# EAGLE design horta (EAGLE 9.6.2)
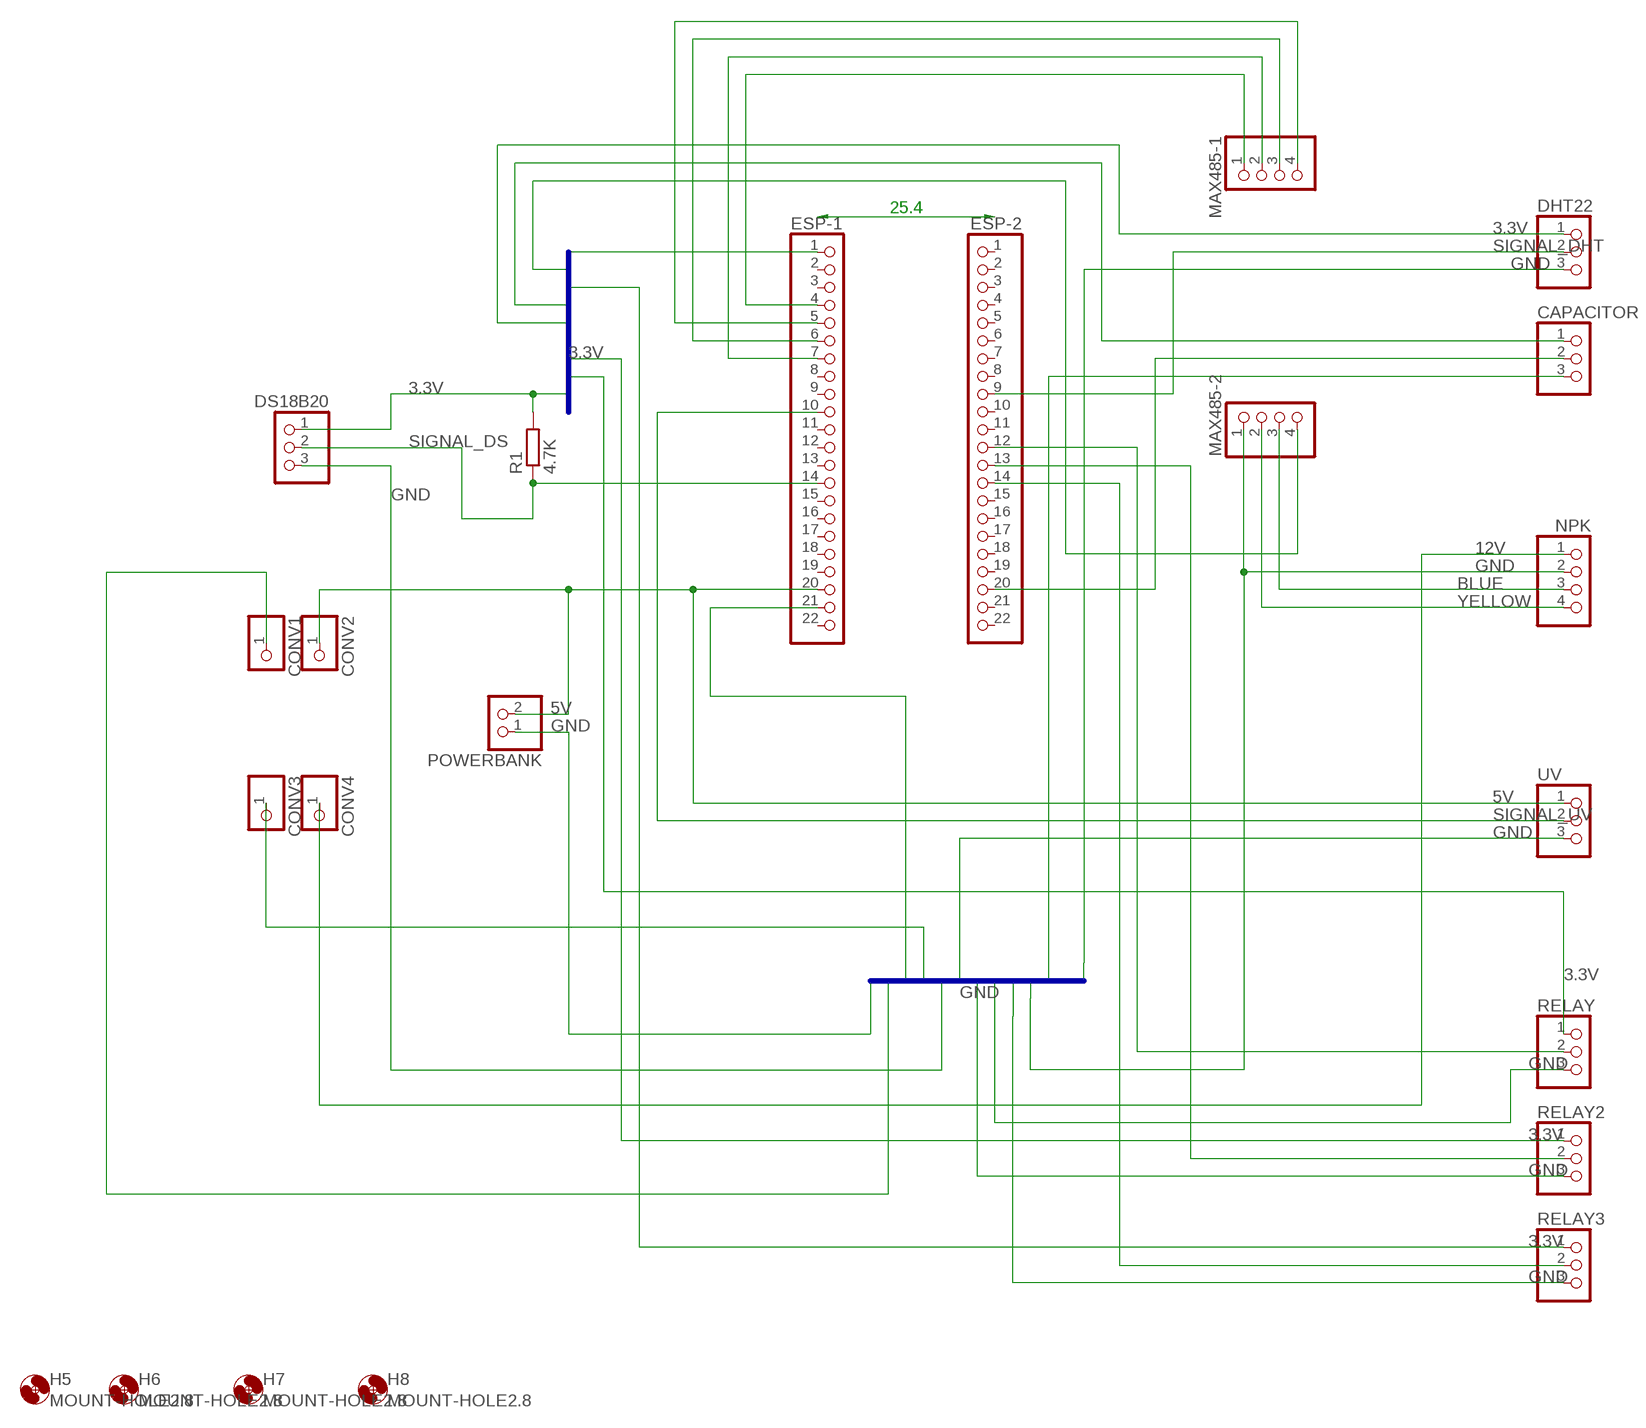
[diagram p0: schematic, sheet 1]

## Parts
CAPACITOR  PINHD-1X3  [1X03]
CONV1  PINHD-1X1  [1X01]
CONV2  PINHD-1X1  [1X01]
CONV3  PINHD-1X1  [1X01]
CONV4  PINHD-1X1  [1X01]
DHT22  PINHD-1X3  [1X03]
DS18B20  PINHD-1X3  [1X03]
ESP-1  PINHD-1X22  [1X22]
ESP-2  PINHD-1X22  [1X22]
H5  MOUNT-HOLE2.8  [2,8]
H6  MOUNT-HOLE2.8  [2,8]
H7  MOUNT-HOLE2.8  [2,8]
H8  MOUNT-HOLE2.8  [2,8]
MAX485-1  PINHD-1X4  [1X04]
MAX485-2  PINHD-1X4  [1X04]
NPK  PINHD-1X4  [1X04]
POWERBANK  PINHD-1X2  [1X02]
R1  4.7K  R-EU_0207/10  [0207/10]
RELAY  PINHD-1X3  [1X03]
RELAY2  PINHD-1X3  [1X03]
RELAY3  PINHD-1X3  [1X03]
UV  PINHD-1X3  [1X03]

## Nets
3.3V: CAPACITOR.1 DHT22.1 DS18B20.1 ESP-1.1 MAX485-2.4 R1.2 RELAY2.1 RELAY3.1 RELAY.1
5V: CONV2.1 ESP-1.20 POWERBANK.2 UV.1
12V: CONV4.1 NPK.1
BLUE: MAX485-2.3 NPK.3
GND: CAPACITOR.3 CONV1.1 CONV3.1 DHT22.3 DS18B20.3 ESP-1.21 MAX485-2.1 NPK.2 POWERBANK.1 RELAY2.3 RELAY3.3 RELAY.3 UV.3
N$1: ESP-1.4 MAX485-1.1
N$2: ESP-1.5 MAX485-1.4
N$3: ESP-1.6 MAX485-1.3
N$4: ESP-1.7 MAX485-1.2
N$5: ESP-2.12 RELAY.2
N$6: CAPACITOR.2 ESP-2.20
N$12: ESP-2.14 RELAY3.2
N$13: ESP-2.13 RELAY2.2
SIGNAL_DHT: DHT22.2 ESP-2.9
SIGNAL_DS: DS18B20.2 ESP-1.14 R1.1
SIGNAL_UV: ESP-1.10 UV.2
YELLOW: MAX485-2.2 NPK.4
Unconnected: ESP-1.2 ESP-1.3 ESP-1.8 ESP-1.9 ESP-1.11 ESP-1.12 ESP-1.13 ESP-1.15 ESP-1.16 ESP-1.17 ESP-1.18 ESP-1.19 ESP-1.22 ESP-2.1 ESP-2.2 ESP-2.3 ESP-2.4 ESP-2.5 ESP-2.6 ESP-2.7 ESP-2.8 ESP-2.10 ESP-2.11 ESP-2.15 ESP-2.16 ESP-2.17 ESP-2.18 ESP-2.19 ESP-2.21 ESP-2.22

## Buses
3.3V
GND

## Library data of the parts
CAPACITOR DHT22 DS18B20 RELAY RELAY2 RELAY3 UV = pinhead:PINHD-1X3: PIN HEADER
CONV1-CONV4 = pinhead:PINHD-1X1: PIN HEADER
ESP-1 ESP-2 = pinhead:PINHD-1X22: PIN HEADER
H5-H8 = holes:MOUNT-HOLE: MOUNTING HOLE with drill center marker
MAX485-1 MAX485-2 NPK = pinhead:PINHD-1X4: PIN HEADER
POWERBANK = pinhead:PINHD-1X2: PIN HEADER
R1 = ada4622:R-EU_: RESISTOR, European symbol

## Board
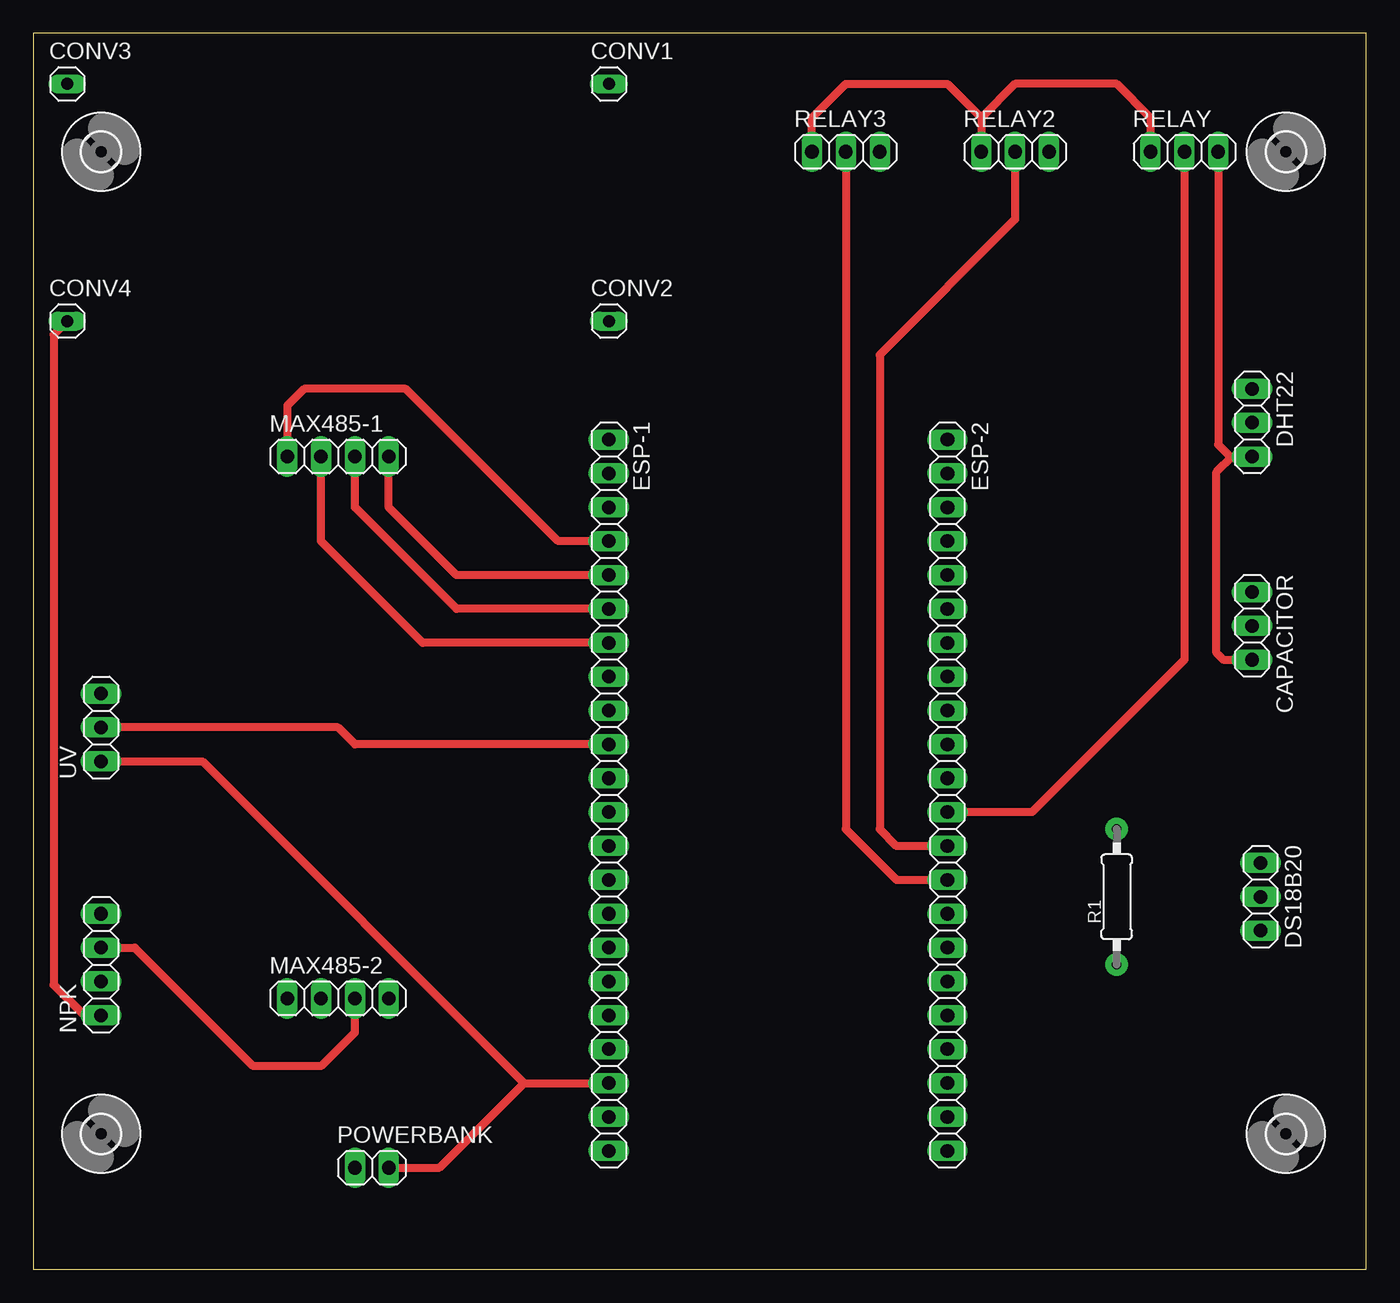
[diagram p1: board, top side]
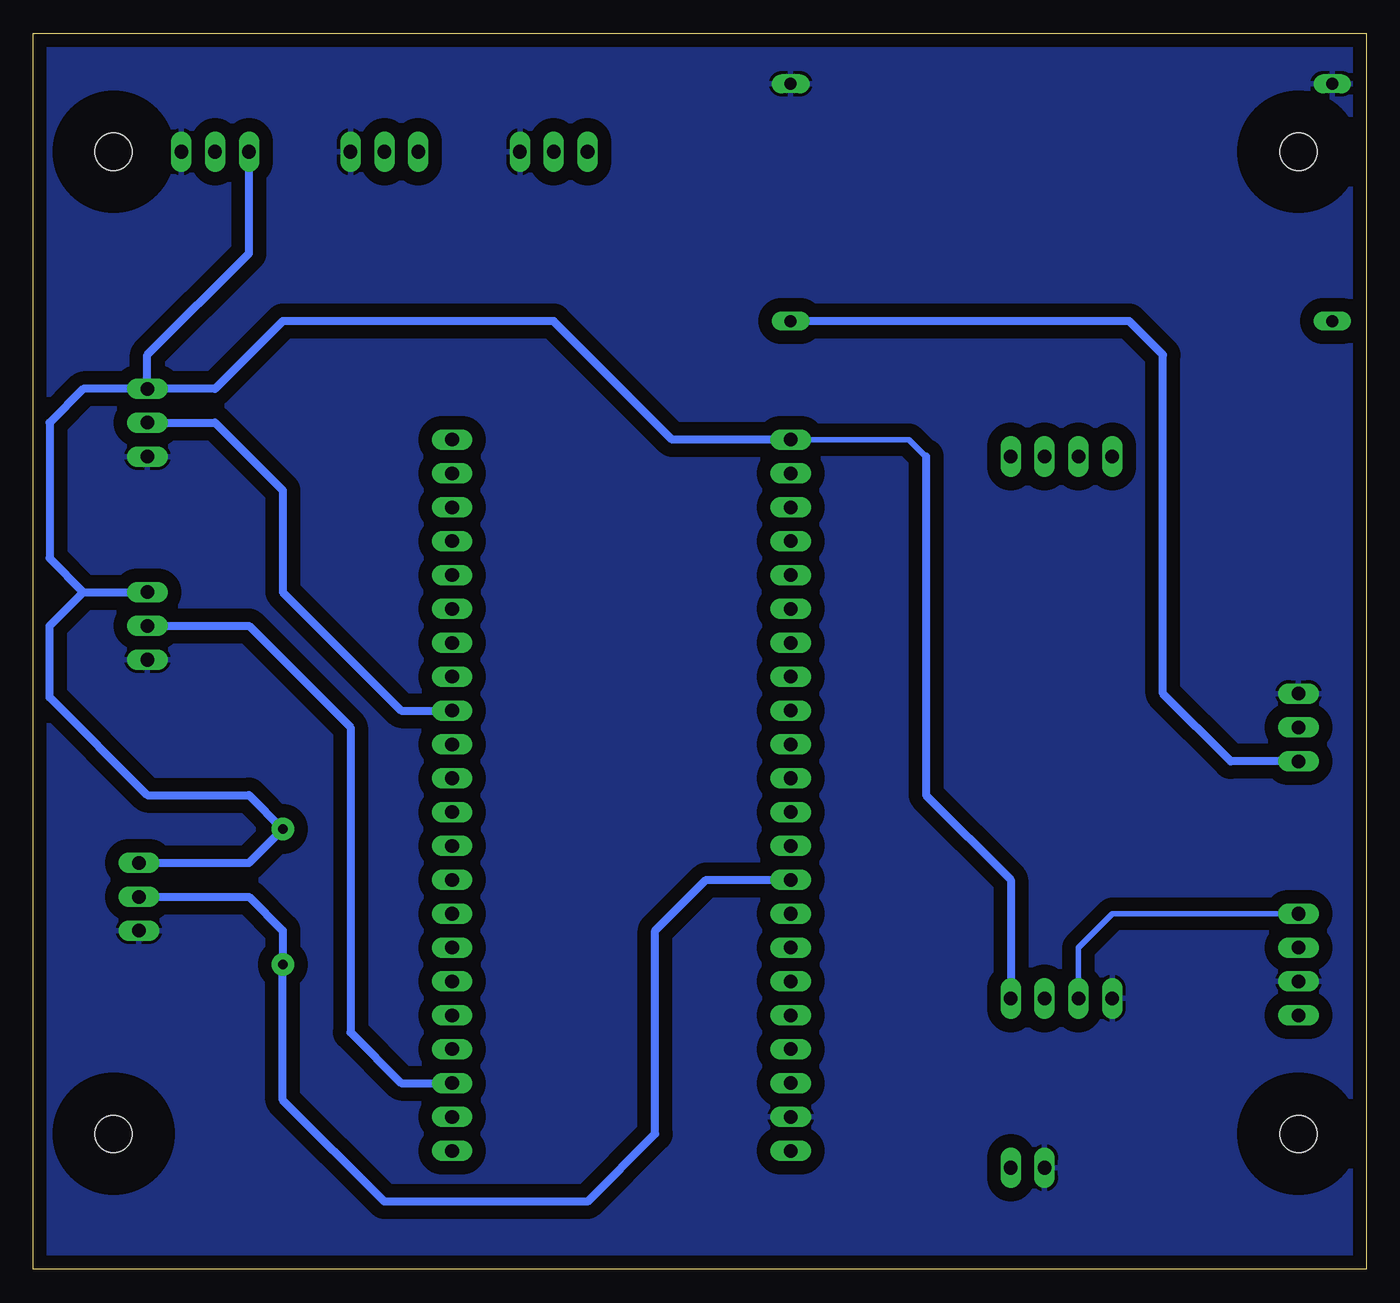
[diagram p2: board, bottom side, seen from below]

Size 100 x 92.7 mm. Coordinates in mm from the lower left corner, seen from the top.
Outline: 0,0 100,0 100,92.7 0,92.7 0,0
Copper layers (1*16): Top 0.035mm / dielectric 1.5mm / Bottom 0.035mm
Design rules "default": minimum track width 6mil, minimum drill 0.35mm, track to track 6mil, track to pad 6mil, pad to pad 6mil, via to via 6mil, smd to smd 6mil, copper to edge 40mil, drill to drill 6mil, minimum pad ring 10mil, minimum via ring 8mil, stop-mask expansion 4mil, vias tented up to drill 0mil, thermal gap 10mil

### Footprints (pad centres in the part's own frame; a part is rotated, then mirrored left to right if it is on the bottom)
1X03 = drill 1.016 long: 1 -2.54,0; 2 0,0; 3 2.54,0
1X01 = drill 0.9 pad 1.3 long: 1 0,0
1X22 = drill 1.016 long: 1 -26.67,0; 2 -24.13,0; 3 -21.59,0; 4 -19.05,0; 5 -16.51,0; 6 -13.97,0; 7 -11.43,0; 8 -8.89,0; 9 -6.35,0; 10 -3.81,0; 11 -1.27,0; 12 1.27,0; 13 3.81,0; 14 6.35,0; 15 8.89,0; 16 11.43,0; 17 13.97,0; 18 16.51,0; 19 19.05,0; 20 21.59,0; 21 24.13,0; 22 26.67,0
2,8 = hole 2.8: 0,0
1X04 = drill 1.016 long: 1 -3.81,0; 2 -1.27,0; 3 1.27,0; 4 3.81,0
1X02 = drill 1.016 long: 1 -1.27,0; 2 1.27,0
0207/10 = drill 0.7 pad 1.676: 1 -5.08,0; 2 5.08,0

### Placement (x,y rotation side)
CAPACITOR  91.44,48.26 270 top
CONV1  43.18,88.9 0 top
CONV2  43.18,71.12 0 top
CONV3  2.54,88.9 0 top
CONV4  2.54,71.12 0 top
DHT22  91.44,63.5 270 top
DS18B20  92.08,27.94 270 top
ESP-1  43.18,35.56 270 top
ESP-2  68.58,35.56 270 top
H5  5.08,83.82 0 top
H6  93.98,83.82 0 top
H7  5.08,10.16 0 top
H8  93.98,10.16 0 top
MAX485-1  22.86,60.96 0 top
MAX485-2  22.86,20.32 0 top
NPK  5.08,22.86 90 top
POWERBANK  25.4,7.62 0 top
R1  81.28,27.94 90 top
RELAY  86.36,83.82 0 top
RELAY2  73.66,83.82 0 top
RELAY3  60.96,83.82 0 top
UV  5.08,40.64 90 top

### Tracks (layer width: path | path; a pad name or v marks a point on that pad's centre or on a via)
3.3V
  Top 0.61: RELAY3.1 58.42,86.36 60.96,88.9 68.58,88.9 71.12,86.36 | RELAY.1 83.82,86.36 81.28,88.9 73.66,88.9 71.12,86.36 | 71.12,86.36 RELAY2.1
  Bottom 0.406: ESP-1.1 34.29,62.23 33.02,60.96 | 71.12,84.2 RELAY2.1
  Bottom 0.61: ESP-1.1 52.07,62.23 60.96,71.12 81.28,71.12 86.36,66.04 DHT22.1 | DS18B20.1 83.82,30.48 R1.2 83.82,35.56 91.44,35.56 98.78,42.9 98.78,48.26 96.24,50.8 | MAX485-2.4 26.67,29.21 33.02,35.56 33.02,60.96 | DHT22.1 96.24,66.04 98.78,63.5 98.78,53.34 96.24,50.8 | 96.24,50.8 CAPACITOR.1 | DHT22.1 91.44,68.58 83.82,76.2 RELAY.1
5V
  Top 0.61: UV.1 12.7,38.1 36.83,13.97 | 36.83,13.97 ESP-1.20 | POWERBANK.2 30.48,7.62 36.83,13.97
  Bottom 0.61: UV.1 10.16,38.1 15.24,43.18 15.24,68.58 17.78,71.12 CONV2.1
12V
  Top 0.61: NPK.1 3.81,19.05 1.52,21.34 1.52,70.1 CONV4.1
BLUE
  Top 0.61: NPK.3 7.62,24.13 16.51,15.24 21.59,15.24 24.13,17.78 MAX485-2.3
GND
  Top 0.406: 89.79,60.96 DHT22.3
  Top 0.61: RELAY.3 88.9,61.85 89.79,60.96 | DHT22.3 89.92,60.96 88.77,59.82 88.77,46.23 89.28,45.72 CAPACITOR.3
  pour Bottom (isolate 1.016): -2.54,93.98 101.6,93.98 101.6,-10.16 -2.54,-10.16
N$1
  Top 0.61: ESP-1.4 39.37,54.61 27.94,66.04 20.32,66.04 19.05,64.77 MAX485-1.1
N$2
  Top 0.61: MAX485-1.4 26.67,57.15 31.75,52.07 ESP-1.5
N$3
  Top 0.61: ESP-1.6 31.75,49.53 24.13,57.15 MAX485-1.3
N$4
  Top 0.61: ESP-1.7 29.21,46.99 21.59,54.61 MAX485-1.2
N$5
  Top 0.61: RELAY.2 86.36,45.72 74.93,34.29 ESP-2.12
N$6
  Bottom 0.61: CAPACITOR.2 83.82,48.26 76.2,40.64 76.2,17.78 72.39,13.97 ESP-2.20
N$12
  Top 0.61: RELAY3.2 60.96,33.02 64.77,29.21 ESP-2.14
N$13
  Top 0.61: RELAY2.2 73.66,78.74 63.5,68.58 63.5,33.02 64.77,31.75 ESP-2.13
SIGNAL_DHT
  Bottom 0.61: DHT22.2 86.36,63.5 81.28,58.42 81.28,50.8 72.39,41.91 ESP-2.9
SIGNAL_DS
  Bottom 0.61: ESP-1.14 49.53,29.21 53.34,25.4 53.34,10.16 58.42,5.08 73.66,5.08 81.28,12.7 R1.1 81.28,25.4 83.82,27.94 DS18B20.2
SIGNAL_UV
  Top 0.61: UV.2 22.86,40.64 24.13,39.37 ESP-1.10
YELLOW
  Bottom 0.406: NPK.4 19.05,26.67 21.59,24.13 MAX485-2.2